# Altium project RAPID_Spindle_Motor_Controller.PrjPcb
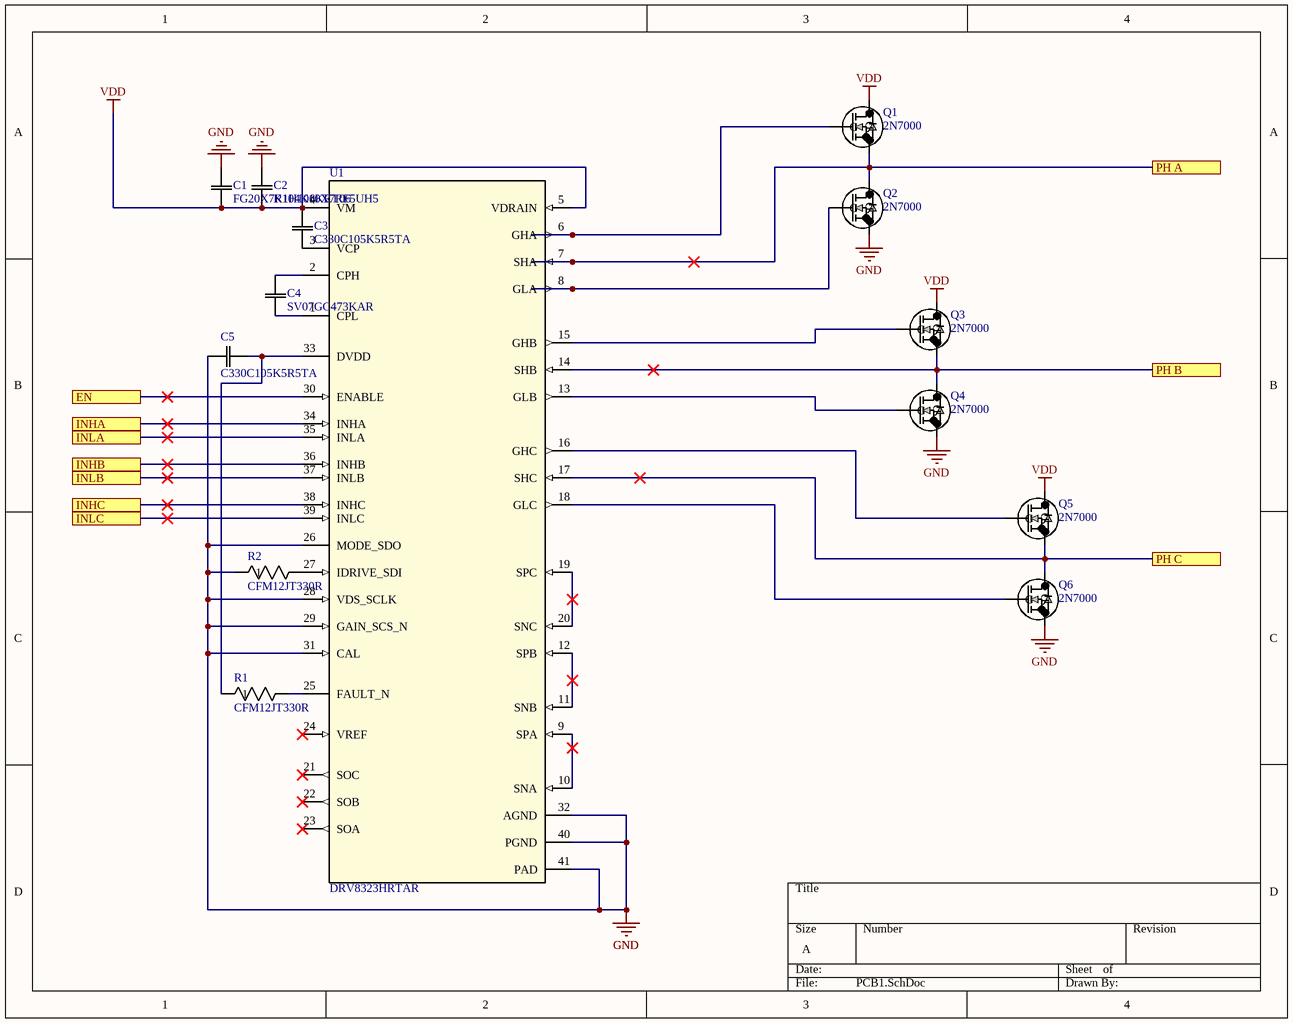
[diagram p0: PCB1.SchDoc]
1 sheet, 14 parts. Net scope: flat (ports and power ports of the same name join across sheets).
Board file: PCB1.PcbDoc

## Sheet PCB1.SchDoc
size A; SheetNumber: 1; SheetTotal: 1

### Parts
C1  FG20X7R1H106KRT06  [CAP_FG20_TDK]
C2  K104K10X7RF5UH5  [K104K10X7RF5UH5_VIS]
C3  C330C105K5R5TA  [CAP_C330C_MR_X7R_KEM]
C4  SV07GC473KAR  [SV07_AVX]
C5  C330C105K5R5TA  [CAP_C330C_MR_X7R_KEM]
Q1  2N7000  [Q_TO-92_135AN_OSI]
Q2  2N7000  [Q_TO-92_135AN_OSI]
Q3  2N7000  [Q_TO-92_135AN_OSI]
Q4  2N7000  [Q_TO-92_135AN_OSI]
Q5  2N7000  [Q_TO-92_135AN_OSI]
Q6  2N7000  [Q_TO-92_135AN_OSI]
R1  CFM12JT330R  [STA_CFM12_STP]
R2  CFM12JT330R  [STA_CFM12_STP]
U1  DRV8323HRTAR  [RTA0040B]

### Ports
EN, INHA, INHB, INHC, INLA, INLB, INLC, PH A, PH B, PH C

### Nets
GND: C1.2 C2.1 C5.2 Q2.1(S) Q4.1(S) Q6.1(S) R2.1 U1.26(MODE_SDO) U1.28(VDS_SCLK) U1.29(GAIN_SCS_N) U1.31(CAL) U1.32(AGND) U1.40(PGND) U1.41(PAD)
VDD: C1.1 C2.2 C3.2 Q1.3(D) Q3.3(D) Q5.3(D) U1.4(VM) U1.5(VDRAIN)
NetC3_1: C3.1 U1.3(VCP)
NetC4_1: C4.1 U1.1(CPL)
NetC4_2: C4.2 U1.2(CPH)
NetC5_1: C5.1 R1.1 U1.33(DVDD)
NetQ1_1: Q1.1(S) Q2.3(D) U1.7(SHA) ; port PH A
NetQ1_2: Q1.2(G) U1.6(GHA)
NetQ2_2: Q2.2(G) U1.8(GLA)
NetQ3_1: Q3.1(S) Q4.3(D) U1.14(SHB) ; port PH B
NetQ3_2: Q3.2(G) U1.15(GHB)
NetQ4_2: Q4.2(G) U1.13(GLB)
NetQ5_1: Q5.1(S) Q6.3(D) U1.17(SHC) ; port PH C
NetQ5_2: Q5.2(G) U1.16(GHC)
NetQ6_2: Q6.2(G) U1.18(GLC)
NetR1_2: R1.2 U1.25(FAULT_N)
NetR2_2: R2.2 U1.27(IDRIVE_SDI)
NetU1_9: U1.9(SPA) U1.10(SNA)
NetU1_11: U1.11(SNB) U1.12(SPB)
NetU1_19: U1.19(SPC) U1.20(SNC)
NetU1_30: U1.30(ENABLE) ; port EN
NetU1_34: U1.34(INHA) ; port INHA
NetU1_35: U1.35(INLA) ; port INLA
NetU1_36: U1.36(INHB) ; port INHB
NetU1_37: U1.37(INLB) ; port INLB
NetU1_38: U1.38(INHC) ; port INHC
NetU1_39: U1.39(INLC) ; port INLC

Not connected (* = marked no-connect by the designer): U1 21(SOC)* 22(SOB)* 23(SOA)* 24(VREF)*

### Library data of the parts
C1 = CMP-009-000000-2: 10 uF; Manufacturer_Name: TDK; Type: Ceramic Capacitor; Copyright: Copyright (C) 2026 Ultra Librarian. All rights reserved.; Design Item ID: FG20X7R1H106KRT06; Manufacturer_Part_Number: FG20X7R1H106KRT06; Source: FG20X7R1H106KRT06.SchLib
C2 = CMP-012-000000-1: K 50V 100nF Â±10% X7R AMMO e3; Manufacturer_Name: Vishay; Type: Ceramic Capacitor; Copyright: Copyright (C) 2025 Ultra Librarian. All rights reserved.; Design Item ID: K104K10X7RF5UH5; Source: K104K10X7RF5UH5.SchLib; Manufacturer_Part_Number: K104K10X7RF5UH5
C3 C5 = CMP-003-000000-2: 1 uF; Manufacturer_Name: Kemet; Type: Ceramic Capacitor; Source: C330C105K5R5TA.SchLib; Manufacturer_Part_Number: C330C105K5R5TA; Design Item ID: C330C105K5R5TA; Copyright: Copyright (C) 2025 Ultra Librarian. All rights reserved.
C4 = CMP-015-000000-2: .047 uF; Manufacturer_Name: KYOCERA AVX; Type: Ceramic Capacitor; Source: SV07GC473KAR.SchLib; Copyright: Copyright (C) 2025 Ultra Librarian. All rights reserved.; Manufacturer_Part_Number: SV07GC473KAR; Design Item ID: SV07GC473KAR
Q1-Q6 = CMP-018-000000-2: MOSFET TO92 N 60V 0.2A 5OHM 150C; Manufacturer_Name: onsemi; Copyright: Copyright (C) 2026 Ultra Librarian. All rights reserved.; Design Item ID: 2N7000; Manufacturer_Part_Number: 2N7000; Source: 2N7000.SchLib
R1 R2 = CMP-021-000000-2: 330 OHM RESISTOR; Manufacturer_Name: Stackpole International; Manufacturer_Part_Number: CFM12JT330R; Source: CFM12JT330R.SchLib; Copyright: Copyright (C) 2026 Ultra Librarian. All rights reserved.; Design Item ID: CFM12JT330R
U1 = CMP-006-000000-1: 65-V max 3-phase smart gate driver with current shunt amplifiers 40-WQFN -40 to 125; Manufacturer_Name: Texas Instruments; Manufacturer_Part_Number: DRV8323HRTAR; Source: DRV8323HRTAR.SchLib; TYPE: TYPE; Design Item ID: DRV8323HRTAR; RefDes: RefDes; Copyright: Copyright (C) 2025 Ultra Librarian. All rights reserved.